# EAGLE design dio_pmod (EAGLE 7.2.0)
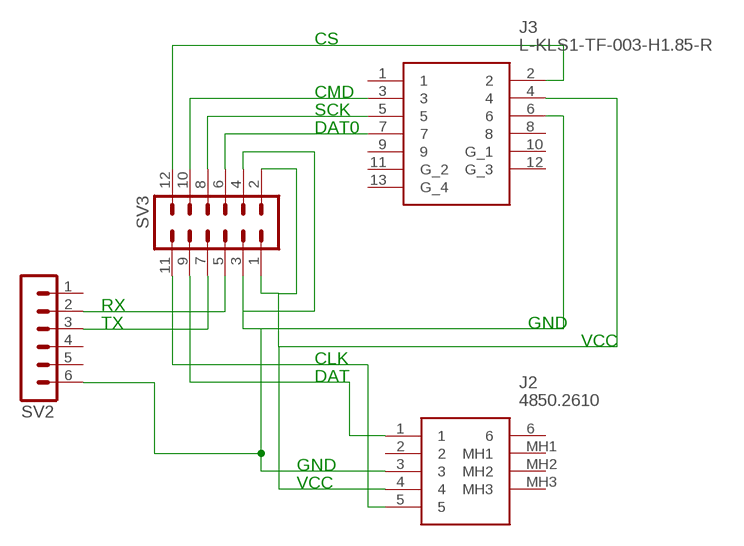
[diagram p0: schematic, sheet 1]

## Parts
J2  4850.2610  [48502610]
J3  L-KLS1-TF-003-H1.85-R  [L-KLS1-TF-003-H1.85-R]
SV2  MA06-1  [MA06-1]
SV3  MA06-2  [MA06-2]

## Nets
GND: J2.3 J3.6 SV2.6 SV3.3 SV3.4
N$1: SV2.2 SV3.5
N$2: SV2.3 SV3.7
N$16: J2.1 SV3.9
N$17: J3.5 SV3.8
N$18: J3.3 SV3.10
N$20: J3.7 SV3.6
N$21: J2.5 SV3.11
N$24: J3.2 SV3.12
VCC: J2.4 J3.4 SV3.1 SV3.2
Unconnected: J2.2 J2.6 J2.MH1 J2.MH2 J2.MH3 J3.1 J3.8 J3.9 J3.10(G_1) J3.11(G_2) J3.12(G_3) J3.13(G_4) SV2.1 SV2.4 SV2.5

## Notes on the sheet
- CS
- CMD
- SCK
- DAT0
- RX
- TX | GND
- VCC
- CLK
- DAT
- GND
- VCC

## Library data of the parts
J2 = mini_din_4850.2610:4850.2610: SCHURTER - 4850.2610 - RECEPTACLE, MINI-DIN, PCB, THT, RA, 6WAY Source: Datasheet <http://www.schurterinc.com/bundles/snceschurter/epim/_ProdPool_/newDS/en/typ_4850.2610.pdf>; ALLIED_NUMBER: 70597687; ALLIED_PRICE-STOCK: https://www.alliedelec.com/schurter-4850-2610/70597687/; DESCRIPTION: SCHURTER - 4850.2610 - RECEPTACLE, MINI-DIN, PCB, THT, RA, 6WAY; HEIGHT: 12mm; MANUFACTURER_NAME: SCHURTER; MANUFACTURER_PART_NUMBER: 4850.2610; MOUSER_PART_NUMBER: 693-4850.2610; MOUSER_PRICE-STOCK: https://www.mouser.com/Search/Refine.aspx?Keyword=693-4850.2610
J3 = L-KLS1-TF-003-H1.85-R:L-KLS1-TF-003-H1.85-R: Micro SD Card Connector Source: Datasheet <https://img.ozdisan.com/ETicaret_Dosya/476392_7149645.pdf>; DESCRIPTION: Micro SD Card Connector; HEIGHT: mm; MANUFACTURER_NAME: KLS Electronic; MANUFACTURER_PART_NUMBER: L-KLS1-TF-003-H1.85-R
SV2 = con-lstb:MA06-1: PIN HEADER; OC_FARNELL: unknown; OC_NEWARK: unknown
SV3 = con-lstb:MA06-2: PIN HEADER; OC_FARNELL: unknown; OC_NEWARK: unknown

## Net classes
0 default: width 0.3 mm, drill 0.5 mm, clearance 0.2 mm

## Board
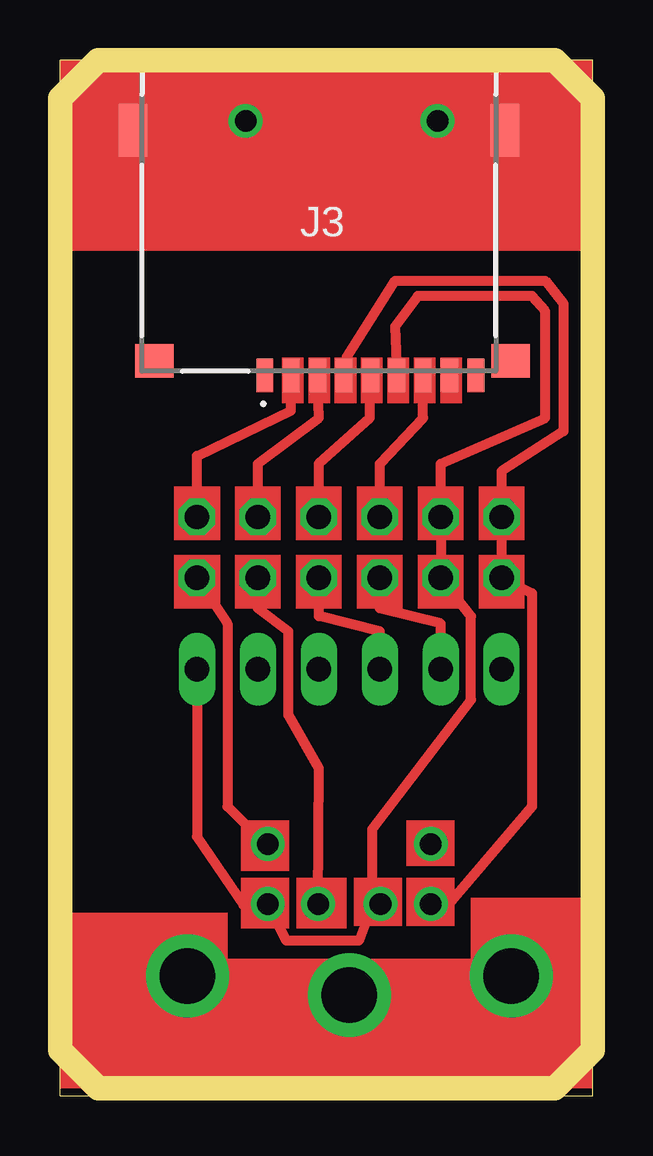
[diagram p1: board, top side]
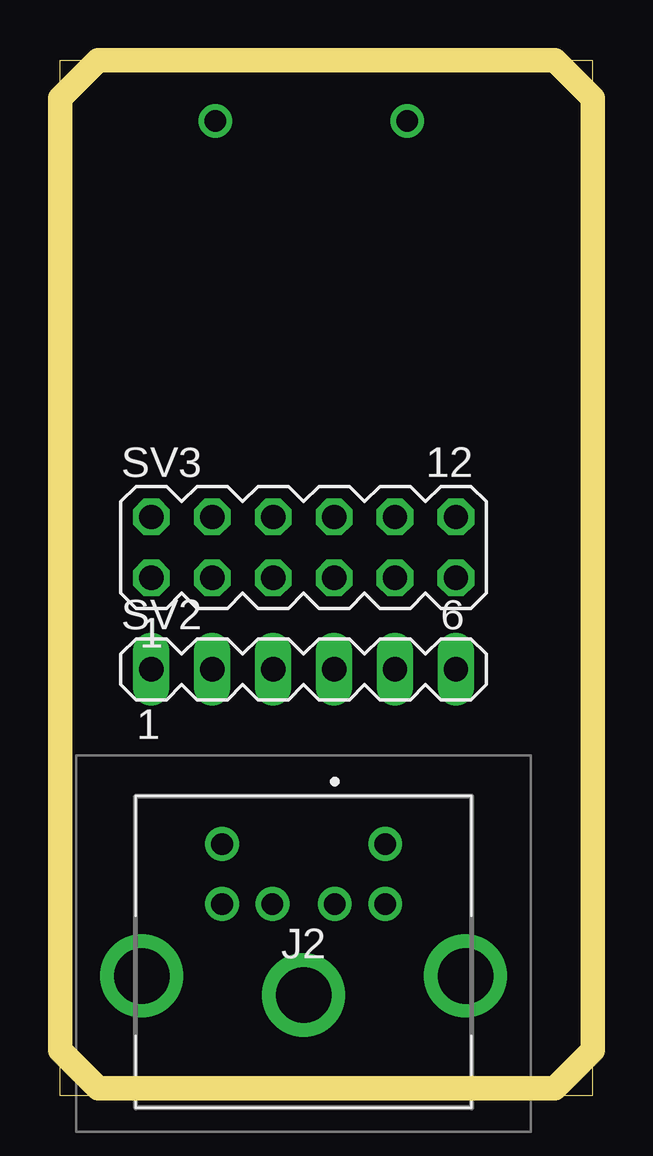
[diagram p2: board, bottom side, seen from below]

Size 22.23 x 43.18 mm. Coordinates in mm from the lower left corner, seen from the top.
Outline: 0,0 22.23,0 22.23,43.18 0,43.18 0,0
Copper layers (1*16): Top 0.035mm / dielectric 1.5mm / Bottom 0.035mm
Design rules "default": minimum track width 10mil, minimum drill 24mil, track to track 8mil, track to pad 8mil, pad to pad 8mil, via to via 8mil, smd to smd 8mil, copper to edge 40mil, drill to drill 8mil, minimum pad ring 10mil, minimum via ring 8mil, stop-mask expansion 4mil, vias tented up to drill 0mil, thermal gap 10mil
Milling: 8 lines

### Footprints (pad centres in the part's own frame; a part is rotated, then mirrored left to right if it is on the bottom)
48502610 = drill 0.9 pad 1.4: 1 1.3,1.65; 2 -1.3,1.65; 3 3.4,1.65; 4 -3.4,1.65; 5 3.4,4.15; 6 -3.4,4.15 | drill 2.309 pad 3.463: MH1 -6.75,-1.35; MH2 6.75,-1.35; MH3 0,-2.15
L-KLS1-TF-003-H1.85-R = smd 0.7 x 1.4: 1 2.25,10.6; 2 1.15,10.6; 3 0.05,10.6; 4 -1.05,10.6; 5 -2.15,10.6; 6 -3.25,10.6; 7 -4.35,10.6; 8 -5.45,10.6; 9 -6.55,10.6 | smd 1.6 x 1.4: 10 -8,10; 13 6.85,10 | smd 1.2 x 2.2: 11 -7.75,0.4; 12 7.75,0.4 | drill 0.9 pad 1.4: 14 3.05,0; 15 -4.95,0
MA06-1 = drill 1.016 long: 1 -6.35,0; 2 -3.81,0; 3 -1.27,0; 4 1.27,0; 5 3.81,0; 6 6.35,0
MA06-2 = drill 1.016 octagon: 1 -6.35,-1.27; 2 -6.35,1.27; 3 -3.81,-1.27; 4 -3.81,1.27; 5 -1.27,-1.27; 6 -1.27,1.27; 7 1.27,-1.27; 8 1.27,1.27; 9 3.81,-1.27; 10 3.81,1.27; 11 6.35,-1.27; 12 6.35,1.27

### Placement (x,y rotation side)
J2  12.07,6.35 0 bottom
J3  10.8,40.64 180 top
SV2  12.07,17.78 0 bottom
SV3  12.07,22.86 0 bottom

### Tracks (layer width: path | path; a pad name or v marks a point on that pad's centre or on a via)
GND
  Top 0.3: 13.97,29.84 J3.6 | 7.66,7.95 J2.3
  Top 0.406: 7.66,7.95 5.71,10.8 SV2.6 | J3.6 13.97,32.07 14.92,33.34 19.69,33.34 20.24,32.7 20.24,28.26 15.88,26.35 SV3.4 SV3.3 17.15,20 17.15,16.51 13.02,11.11 13.02,7.94 12.47,6.47 9.44,6.47 J2.3
N$1
  Top 0.406: SV2.2 15.88,19.68 13.34,20.32 SV3.5
N$2
  Top 0.406: SV2.3 13.34,19.37 10.8,20 SV3.7
N$16
  Top 0.406: J2.1 10.8,13.65 9.53,15.88 9.53,19.37 8.26,20.32 SV3.9
N$17
  Top 0.406: SV3.8 10.8,26.35 12.92,28.26 J3.5
N$18
  Top 0.406: SV3.10 8.26,26.35 10.8,28.26 J3.3
N$20
  Top 0.406: SV3.6 13.34,26.35 15.14,28.26 J3.7
N$21
  Top 0.3: 8.26,10.8 J2.5
  Top 0.406: 8.26,10.8 6.99,12.07 6.99,19.68 SV3.11
N$24
  Top 0.406: SV3.12 5.71,26.67 9.63,28.56 J3.2
VCC
  Top 0.3: 11.97,30.81 12.07,30.48 J3.4 | 16.18,7.95 J2.4
  Top 0.406: 16.18,7.95 19.69,12.07 19.69,20.95 SV3.1 SV3.2 18.42,26.04 20.99,27.7 20.99,33.02 20.24,33.97 13.97,33.97 11.97,30.81
(copper drawn outside any net)
  shapes: Top area x29